# Altium schematic sheet RS232&IrDA.SchDoc
size A4; Revision: D.1(PCB.SCH)
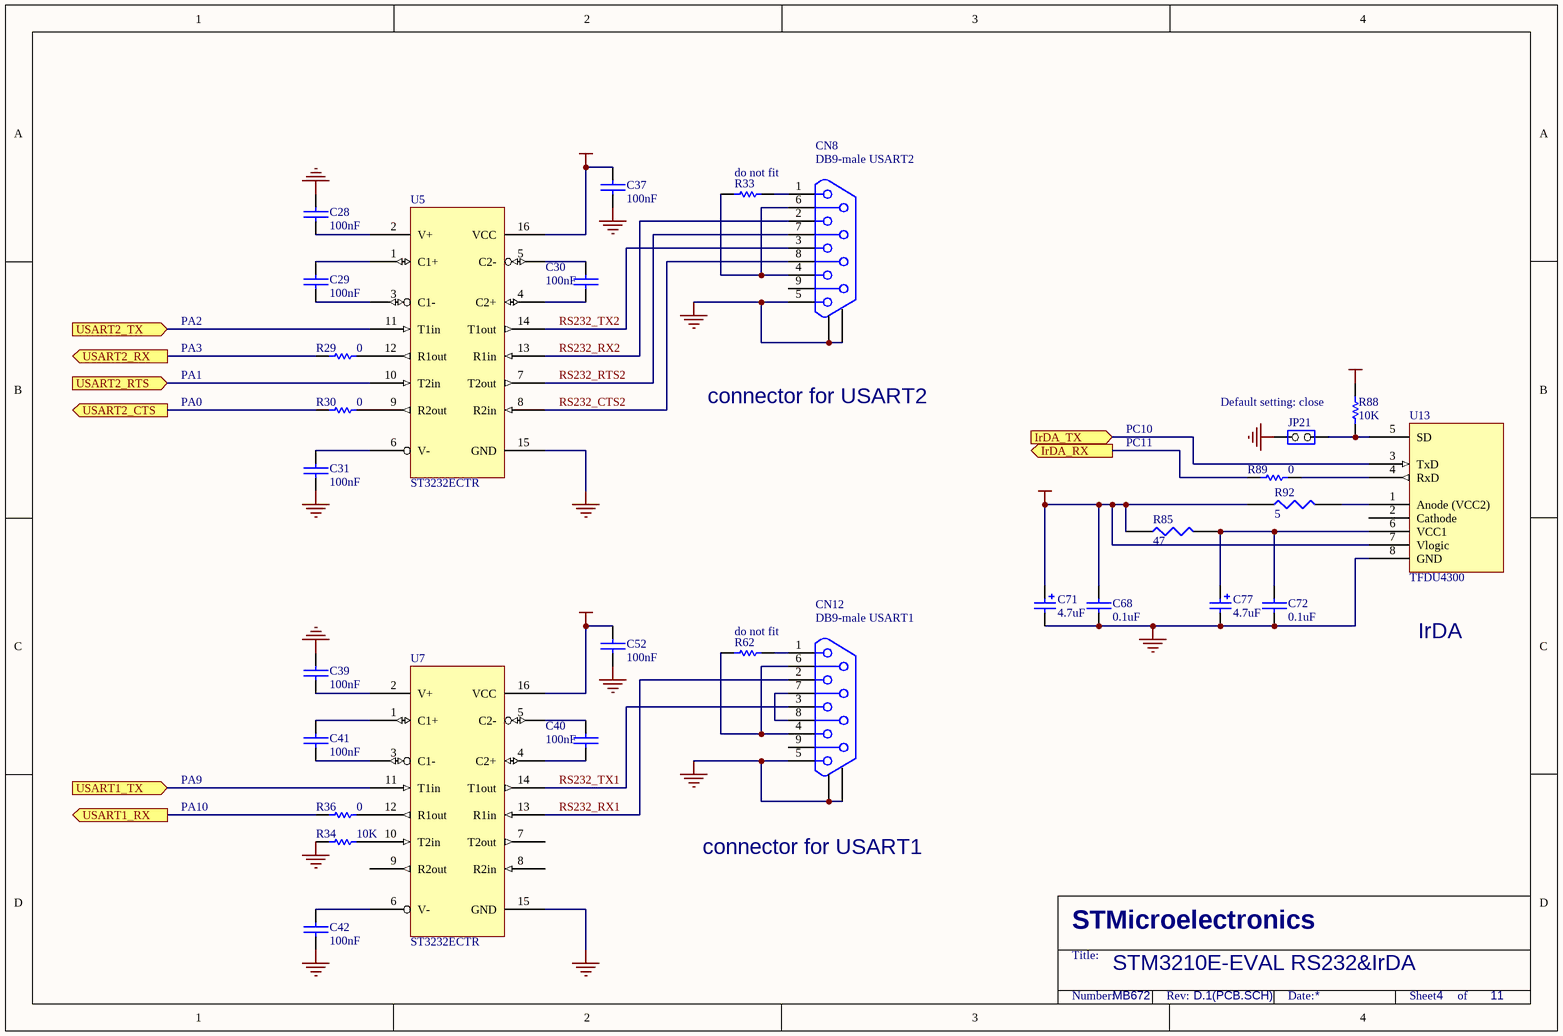
[diagram p0: RS232&IrDA.SchDoc]

## Parts
C28  100nF  [0603P]
C29  100nF  [0603P]
C30  100nF  [0603P]
C31  100nF  [0603P]
C37  100nF  [0603P]
C39  100nF  [0603P]
C40  100nF  [0603P]
C41  100nF  [0603P]
C42  100nF  [0603P]
C52  100nF  [0603P]
C68  0.1uF  [0603P]
C71  4.7uF  [TAN-B]
C72  0.1uF  [0603P]
C77  4.7uF  [TAN-B]
CN8  DB9-male USART2  [DB9/M]
CN12  DB9-male USART1  [DB9/M]
JP21  (no value)  [SIP2]
R29  0  [0805]
R30  0  [0805]
R33  do not fit  [0603_NC]
R34  10K  [0603]
R36  0  [0805]
R62  do not fit  [0603_NC]
R85  47  [0603]
R88  10K  [0603]
R89  0  [0805]
R92  5  [0603]
U5  ST3232ECTR  [TSSOP16]
U7  ST3232ECTR  [TSSOP16]
U13  TFDU4300  [IR_VISHAY3]

## Ports
IrDA_RX (out), IrDA_TX (in), USART1_RX (out), USART1_TX (in), USART2_CTS (out), USART2_RTS (in), USART2_RX (out), USART2_TX (in)

## Nets
+3V3: C37.1 C52.1 C68.1 C71.1 R85.1 R88.2 R92.1 U5.16(VCC) U7.16(VCC) U13.7(Vlogic)
GND: C28.1 C31.1 C37.2 C39.1 C42.1 C52.2 C68.2 C71.2 C72.2 C77.2 CN8.0 CN8.5 CN12.0 CN12.5 JP21.2(NO) R34.2 U5.15(GND) U7.15(GND) U13.8(GND)
IrDA_RX: R89.2 ; port IrDA_RX
IrDA_TX: U13.3(TxD) ; port IrDA_TX
RS232_CTS2: CN8.8 U5.8(R2in)
RS232_RTS2: CN8.7 U5.7(T2out)
RS232_RX1: CN12.2 U7.13(R1in)
RS232_RX2: CN8.2 U5.13(R1in)
RS232_TX1: CN12.3 U7.14(T1out)
RS232_TX2: CN8.3 U5.14(T1out)
USART1_RX: R36.2 ; port USART1_RX
USART1_TX: U7.11(T1in) ; port USART1_TX
USART2_CTS: R30.2 ; port USART2_CTS
USART2_RTS: U5.10(T2in) ; port USART2_RTS
USART2_RX: R29.2 ; port USART2_RX
USART2_TX: U5.11(T1in) ; port USART2_TX
NetC28_2: C28.2 U5.2(V+)
NetC29_1: C29.1 U5.1(C1+)
NetC29_2: C29.2 U5.3(C1-)
NetC30_1: C30.1 U5.4(C2+)
NetC30_2: C30.2 U5.5(C2-)
NetC31_2: C31.2 U5.6(V-)
NetC39_2: C39.2 U7.2(V+)
NetC40_1: C40.1 U7.4(C2+)
NetC40_2: C40.2 U7.5(C2-)
NetC41_1: C41.1 U7.1(C1+)
NetC41_2: C41.2 U7.3(C1-)
NetC42_2: C42.2 U7.6(V-)
NetC72_1: C72.1 C77.1 R85.2 U13.6(VCC1)
NetCN8_1: CN8.1 R33.2
NetCN8_4: CN8.4 CN8.6 R33.1
NetCN12_1: CN12.1 R62.2
NetCN12_4: CN12.4 CN12.6 R62.1
NetCN12_7: CN12.7 CN12.8
NetJP21_1: JP21.1(COMMON) R88.1 U13.5(SD)
NetR29_1: R29.1 U5.12(R1out)
NetR30_1: R30.1 U5.9(R2out)
NetR34_1: R34.1 U7.10(T2in)
NetR36_1: R36.1 U7.12(R1out)
NetR89_1: R89.1 U13.4(RxD)
NetR92_2: R92.2 U13.1(Anode_(VCC2))

Not connected (* = marked no-connect by the designer): CN8 9; CN12 9; U7 7(T2out) 8(R2in) 9(R2out); U13 2(Cathode)

## Notes on the sheet
- PA1
- PA2
- PA3
- PA0
- connector for USART2
- PC10
- PC11
- (near R88) Default setting: close
- IrDA
- PA9
- PA10
- connector for USART1
- STM3210E-EVAL RS232&IrDA
- MB672
- 4
- 11
- STMicroelectronics
- Title:
- Number:
- Rev:
- Date:
- Sheet       of

## Library data of the parts
C28-C31 C37 C39-C42 C52 C68 C72 = CAP: Capacitor
C71 C77 = Cap Pol1: Polarized Capacitor (Radial); Value: 100pF; Published: 8-Jun-2000; Revision: July-2002: Re-released for DXP Platform.; Publisher: Altium Limited
CN8 CN12 = DB9
JP21 = JP2
R29 R30 R34 R36 R88 R89 = Res1: Resistor; Value: 1K; Published: 8-Jun-2000; Revision: July-2002: Re-released for DXP Platform.; Publisher: Altium Limited
R33 R62 = res1: Resistor; Value: 1K; Published: 8-Jun-2000; Revision: July-2002: Re-released for DXP Platform.; Publisher: Altium Limited
R85 R92 = RES1
U5 U7 = ST3232: 3.3V/5V Dual RS232 Transceiver w/ Int. Cap.